# Altium schematic sheet Cosmic.SchDoc
size A; SheetNumber: 3; SheetTotal: 3
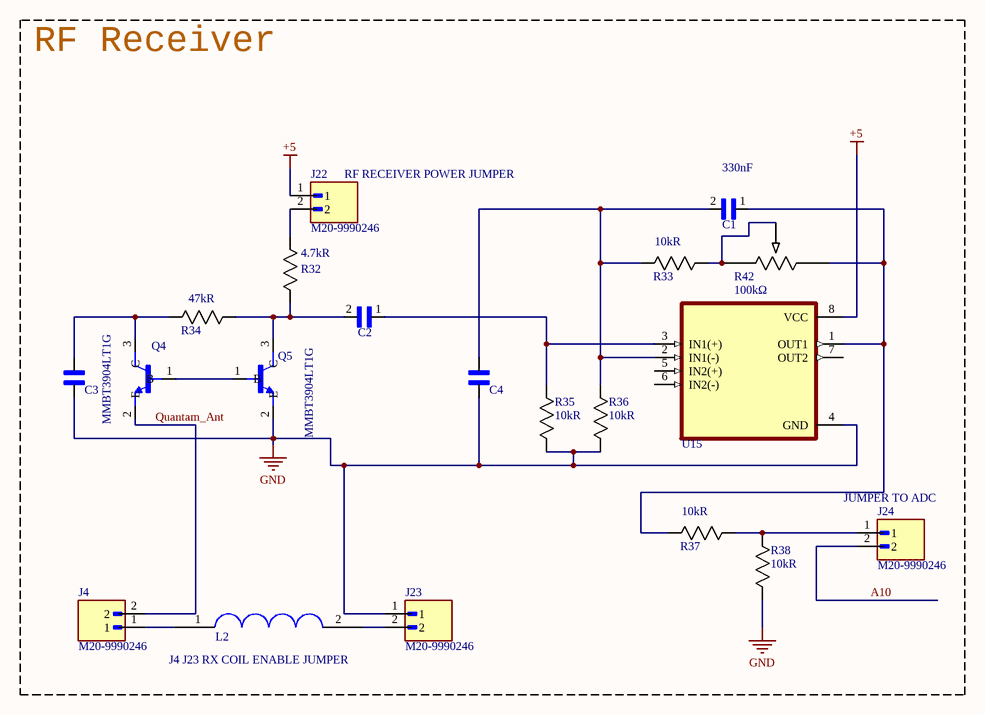
[diagram p0: Cosmic.SchDoc]

## Parts
C1  Capacitance: 330nF  [CAP_1206]  (hidden comment: GRM31C5C1E334GE01L)
C2  GRM31C5C1E334GE01L  [CAP_1206]  (value not drawn)
C3  CL21A106KOQNNNG  [CAPC2012X140N]  (value not drawn)
C4  CL21A106KOQNNNG  [CAPC2012X140N]  (value not drawn)
J4  M20-9990246  [HARWIN_M20-9990246]
J22  M20-9990246  [HARWIN_M20-9990246]
J23  M20-9990246  [HARWIN_M20-9990246]
J24  M20-9990246  [HARWIN_M20-9990246]
L2  COIL_PLANNER_A  [COIL_PLANNER_A]  (value not drawn)  (no BOM)
Q4  MMBT3904LT1G  [SOT95P240X111-3N]
Q5  MMBT3904LT1G  [SOT95P240X111-3N]
R32  Resistance: 4.7kR  [STA_RMCF1206_STP-L]  (hidden comment: RC1206FR-074K7L)
R33  Resistance: 10kR  [STA_RMCF1206_STP-L]  (hidden comment: RC1206FR-0710KL)
R34  Resistance: 47kR  [STA_RMCF1206_STP-L]  (hidden comment: CRGCQ1206F47K)
R35  Resistance: 10kR  [STA_RMCF1206_STP-L]  (hidden comment: RC1206FR-0710KL)
R36  Resistance: 10kR  [STA_RMCF1206_STP-L]  (hidden comment: RC1206FR-0710KL)
R37  Resistance: 10kR  [STA_RMCF1206_STP-L]  (hidden comment: RC1206FR-0710KL)
R38  Resistance: 10kR  [STA_RMCF1206_STP-L]  (hidden comment: RC1206FR-0710KL)
R42  Resistance: 100kΩ  [POT_PV36W_BRN]  (hidden comment: PV36W104C01B00)
U15  LM358MX/NOPB  [SOIC127P599X175-8N]  (value not drawn)

## Nets
+5: J22.1 U15.8(VCC)
GND: C3.1 C4.1 J23.1 Q5.2(E) R35.1 R36.1 R38.1 U15.4(GND)
A10: J24.2
Quantam_Ant: J4.2 Q4.2(E)
NetC1_1: C1.1 R37.1 R42.3 U15.1(OUT1)
NetC1_2: C1.2 C4.2 R33.1 R36.2 U15.2(IN1(-))
NetC2_1: C2.1 R35.2 U15.3(IN1(+))
NetC2_2: C2.2 Q5.3(C) R32.1 R34.2
NetC3_2: C3.2 Q4.3(C) R34.1
NetJ4_1: J4.1 L2.1
NetJ22_2: J22.2 R32.2
NetJ23_2: J23.2 L2.2
NetJ24_1: J24.1 R37.2 R38.2
NetQ4_1: Q4.1(B) Q5.1(B)
NetR33_2: R33.2 R42.1 R42.2

Not connected (* = marked no-connect by the designer): U15 5(IN2(+)) 6(IN2(-)) 7(OUT2)

## Notes on the sheet
- RF Receiver
- (near J22) RF RECEIVER POWER JUMPER
- (near J24) JUMPER TO ADC
- (near L2) J4 J23 RX COIL ENABLE JUMPER

## Library data of the parts
C1 = C334_1206: Cap, 0.33Uf, 25V, 1206, C0G/Np0 Rohs Compliant: Yes |Murata GRM31C5C1E334GE01L; Manufacturer: Murata; Material: 4241ConductorMaterial; Temperature Coefficient: 30ppm/°C; Tolerance: 2%; Supplier 1: Digikey; Manufacturer Part Number: GRM31C5C1E334GE01L; RoHS: No; Category: Ceramic Capacitors; Stock 1: 1673; Pricing 1: 1=0.81, 10=0.508, 50=0.391, 100=0.3549, 500=0.31812, 1000=0.30146 (USD); Case/Package: 340Case; Min Operating Temperature: -55°C; Max Operating Temperature: 125°C; Voltage Rating: 25V; Voltage Rating (DC): 25V; Length: 3.2mm; Width: 1.6mm; Height: 1.8mm; Thickness: 1.6mm; RoHS Compliant: Yes; ComponentLink1URL: https://datasheet.octopart.com/GRM31C5C1E334GE01L-Murata-datasheet-165579666.pdf?src-supplier=TME; ComponentLink1Description: https://datasheet.octopart.com/GRM31C5C1E334GE01L-Murata-datasheet-165579666.pdf?src-supplier=TME; Supplier Part Number 1: 490-GRM31C5C1E334GE01LCT-ND
C2 = C334_1206: Cap, 0.33Uf, 25V, 1206, C0G/Np0 Rohs Compliant: Yes |Murata GRM31C5C1E334GE01L; Manufacturer: Murata; Material: 4241ConductorMaterial; Capacitance: 330nF; Temperature Coefficient: 30ppm/°C; Tolerance: 2%; Supplier 1: Digikey; Manufacturer Part Number: GRM31C5C1E334GE01L; RoHS: No; Category: Ceramic Capacitors; Stock 1: 1673; Pricing 1: 1=0.81, 10=0.508, 50=0.391, 100=0.3549, 500=0.31812, 1000=0.30146 (USD); Case/Package: 340Case; Min Operating Temperature: -55°C; Max Operating Temperature: 125°C; Voltage Rating: 25V; Voltage Rating (DC): 25V; Length: 3.2mm; Width: 1.6mm; Height: 1.8mm; Thickness: 1.6mm; RoHS Compliant: Yes; ComponentLink1URL: https://datasheet.octopart.com/GRM31C5C1E334GE01L-Murata-datasheet-165579666.pdf?src-supplier=TME; ComponentLink1Description: https://datasheet.octopart.com/GRM31C5C1E334GE01L-Murata-datasheet-165579666.pdf?src-supplier=TME; Supplier Part Number 1: 490-GRM31C5C1E334GE01LCT-ND
C3 C4 = 10uF16v0805: 10 ÂµF Â±10% 16V Ceramic Capacitor X5R 0805 (2012 Metric); MF: Samsung Electro-Mechanics; SnapEDA_Link: https://www.snapeda.com/parts/CL21A106KOQNNNG/Samsung/view-part/?ref=snap; Package: 2012-2 SAMSUNG; Value: *; MP: CL21A106KOQNNNG; Check_prices: https://www.snapeda.com/parts/CL21A106KOQNNNG/Samsung/view-part/?ref=eda; Supplier Part Number 1: 1276-6455-2-ND
J4 J22-J24 = M20-9990246: 2.54mm (0.1) Pitch SIL Vertical Throughboard Pin Header, 6.1mm mating pin height, tin, 2 contacts; MF: Harwin; SnapEDA_Link: https://www.snapeda.com/parts/M20-9990246/Harwin/view-part/?ref=snap; Package: None; Value: *; MP: M20-9990246; Check_prices: https://www.snapeda.com/parts/M20-9990246/Harwin/view-part/?ref=eda; Supplier Part Number 1: 952-2262-ND
Q4 Q5 = MMBT3904LT1G: Transistor, Bipolar,Si,NPN,General Purpose,VCEO 40VDC,IC 200mA,PD 225mW,SOT-23 | ON Semiconductor MMBT3904LT1G; SnapEDA_Link: https://www.snapeda.com/parts/MMBT3904LT1G/Onsemi/view-part/?ref=snap; Package: SOT-23-3 ON Semiconductor; Value: *; MF: ON Semiconductor; MP: MMBT3904LT1G; Check_prices: https://www.snapeda.com/parts/MMBT3904LT1G/Onsemi/view-part/?ref=eda; Supplier Part Number 1: MMBT3904LT1GOSTR-ND
R32 = R4K7_1206F: SMD Chip Resistor 4.7 Kohm ½ 1% 250 Mw 1206 [3216 Metric] Thick Film General Purpose; Manufacturer: Yageo; Voltage Rating: 200V; Power Rating: 250mW; Temperature Coefficient: 100ppm/°C; Supplier 1: Digikey; Manufacturer Part Number: RC1206FR-074K7L; RoHS: Yes; Category: Chip SMD Resistors; Stock 1: 1407521; Pricing 1: 1=0.1, 10=0.015, 25=0.0112, 50=0.0102 (USD); Case/Package: 1206; Number of Pins: 2; Case Code (Imperial): 1206; Case Code (Metric): 3216; Size Code: 1206; Min Operating Temperature: -55°C; Max Operating Temperature: 155°C; Tolerance: 1%; Packaging: Tape and Reel; Voltage Rating (AC): 200V; Voltage Rating (DC): 200V; Resistor Type: Thick Film; Series: RC02H; Resistance Tolerance: 1%; Width: 1.6mm; Lead Free: Lead Free; Reach SVHC Compliant: Unknown; RoHS Compliant: Yes; ComponentLink1URL: https://datasheet.ciiva.com/7857/1692832-7857365.pdf?src-supplier=Element14; ComponentLink1Description: https://datasheet.ciiva.com/7857/1692832-7857365.pdf?src-supplier=Element14; ComponentLink2URL: https://datasheet.ciiva.com/16781/pyu-rc1206-51-rohs-l-4-16781672.pdf?src-supplier=Future+Electronics; ComponentLink2Description: https://datasheet.ciiva.com/16781/pyu-rc1206-51-rohs-l-4-16781672.pdf?src-supplier=Future+Electronics; Supplier Part Number 1: 311-4.70KFRCT-ND
R33 R35-R38 = R10K-1206: 250Mw Thick Film Resistors 100Ppm/ 1% 10K 1206 Chip Resistor Surface Mount Rohs; Manufacturer: Yageo; Voltage Rating: 200V; Temperature Coefficient: 100ppm/°C; Supplier 1: Digikey; Manufacturer Part Number: RC1206FR-0710KL; RoHS: Yes; Category: Chip SMD Resistors; Stock 1: 1307460; Pricing 1: 1=0.1, 10=0.018, 25=0.0152, 50=0.0112 (USD); Case/Package: 1206; Case Code (Imperial): 1206; Case Code (Metric): 3216; Size Code: 1206; Min Operating Temperature: -55°C; Max Operating Temperature: 155°C; Power Rating: 250mW; Tolerance: 1%; Packaging: Tape and Reel; Termination: SMD/SMT; Resistor Type: Thick Film; Series: RC; Resistance Tolerance: 1%; Voltage Rating (AC): 200V; Features: Moisture Resistant; Max Power Dissipation: 250mW; Number of Terminations: 2; Package Quantity: 5000; Length: 3.1mm; Width: 1.6mm; Height: 0.55mm; Lead Free: Lead Free; Reach SVHC Compliant: Unknown; RoHS Compliant: Yes; ComponentLink1URL: https://datasheet.ciiva.com/7857/1692832-7857244.pdf?src-supplier=Element14; ComponentLink1Description: https://datasheet.ciiva.com/7857/1692832-7857244.pdf?src-supplier=Element14; ComponentLink2URL: https://datasheet.ciiva.com/7857/1692832-7857245.pdf?src-supplier=Element14; ComponentLink2Description: https://datasheet.ciiva.com/7857/1692832-7857245.pdf?src-supplier=Element14; ComponentLink3URL: https://datasheet.ciiva.com/46445/444357-46445703.pdf?src-supplier=Element14; ComponentLink3Description: https://datasheet.ciiva.com/46445/444357-46445703.pdf?src-supplier=Element14; Supplier Part Number 1: 311-10.0KFRCT-ND
R34 = R47K1206F: SMD Chip Resistor, 47 kOhm, ± 1%, 250 mW, 1206 [3216 Metric], Thick Film, General Purpose; Manufacturer: TE Connectivity; Max Power Dissipation: 250mW; Temperature Coefficient: 100ppm/°C; Voltage Rating: 200V; Supplier 1: Digikey; Manufacturer Part Number: CRGCQ1206F47K; RoHS: Yes; Category: Chip SMD Resistors; Stock 1: 608846; Pricing 1: 1=0.1, 10=0.046, 25=0.0352, 50=0.0238, 100=0.0196, 250=0.0174, 500=0.01666, 1000=0.01451 (USD); Case/Package: 1206; Case Code (Imperial): 1206; Case Code (Metric): 3216; Min Operating Temperature: -55°C; Max Operating Temperature: 155°C; Features: Moisture Resistant,Automotive AEC-Q200; Packaging: Cut Tape; Tolerance: 1%; Number of Terminations: 2; Series: CRGCQ; Power Rating: 250mW; Voltage Rating (DC): 200V; Operating Supply Voltage: 200V; Height: 650um; Ratings: AEC-Q200; RoHS Compliant: Yes; ComponentLink1URL: https://www.te.com/commerce/DocumentDelivery/DDEController?Action=srchrtrv&DocNm=1773204-3&DocType=DS&DocLang=English&src-supplier=Digikey; ComponentLink1Description: https://www.te.com/commerce/DocumentDelivery/DDEController?Action=srchrtrv&DocNm=1773204-3&DocType=DS&DocLang=English&src-supplier=Digikey; ComponentLink2URL: https://www.te.com/commerce/DocumentDelivery/DDEController?Action=srchrtrv&amp;DocNm=1773204-3&amp;DocType=DS&amp;DocLang=English&src-supplier=Digikey; ComponentLink2Description: https://www.te.com/commerce/DocumentDelivery/DDEController?Action=srchrtrv&amp;DocNm=1773204-3&amp;DocType=DS&amp;DocLang=English&src-supplier=Digikey; ComponentLink3URL: https://4donline.ihs.com/images/VipMasterIC/IC/TYEL/TYEL-S-A0004929575/TYEL-S-A0004929575-1.pdf?hkey=52A5661711E402568146F3353EA87419&src-supplier=Farnell; ComponentLink3Description: https://4donline.ihs.com/images/VipMasterIC/IC/TYEL/TYEL-S-A0004929575/TYEL-S-A0004929575-1.pdf?hkey=52A5661711E402568146F3353EA87419&src-supplier=Farnell; ComponentLink4URL: https://datasheet.octopart.com/CRGCQ1206F47K-TE-Connectivity-datasheet-114679081.pdf?src-supplier=Master+Electronics; ComponentLink4Description: https://datasheet.octopart.com/CRGCQ1206F47K-TE-Connectivity-datasheet-114679081.pdf?src-supplier=Master+Electronics; Supplier Part Number 1: A129830CT-ND
R42 = POT100K: Cermet trimmer potentiometer, 25 turns, 100 kΩ, 0.5 W, THT, on top, PV36W104C01B00; Manufacturer: Bourns; Lead Diameter: 510µm; Lead Length: 6.4mm; Max Power Dissipation: 500mW; Number of Turns: 25; Temperature Coefficient: 100ppm/°C; Tolerance: 10%; Supplier 1: DigiKey; Manufacturer Part Number: PV36W104C01B00; RoHS: Compliant; Category: Variable Resistors and Potentiometers; Stock 1: 59475; Pricing 1: 1=1.53, 10=1.291, 25=1.2048, 50=1.1432, 100=1.0844, 250=1.01108, 500=0.95864, 1000=0.90877, 5000=0.80229 (USD); Composition: Cermet; Contact Plating: Tin; Height: 10.03mm; Lifecycle Status: Production; Max Operating Temperature: 125°C; Min Operating Temperature: -55°C; Mount: Through Hole; Number of Terminals: 3; Power Dissipation: 500mW; REACH SVHC: No; Schedule B: 8533400080, 8533400080|8533400080|8533400080|8533400080|8533400080; Termination: PC Pins; Width: 4.83mm; ComponentLink1URL: https://datasheet.octopart.com:443/PV36W104C01B00-Bourns-datasheet-182141976.pdf?src-supplier=IHS; ComponentLink1Description: https://datasheet.octopart.com:443/PV36W104C01B00-Bourns-datasheet-182141976.pdf?src-supplier=IHS; ComponentLink2URL: https://datasheet.octopart.com:443/PV36W104C01B00-Bourns-datasheet-154729827.pdf?src-supplier=Electro+Sonic; ComponentLink2Description: https://datasheet.octopart.com:443/PV36W104C01B00-Bourns-datasheet-154729827.pdf?src-supplier=Electro+Sonic; ComponentLink3URL: https://datasheet.octopart.com:443/PV36W104C01B00-Bourns-datasheet-177040424.pdf?src-supplier=Burklin+Elektronik; ComponentLink3Description: https://datasheet.octopart.com:443/PV36W104C01B00-Bourns-datasheet-177040424.pdf?src-supplier=Burklin+Elektronik; ComponentLink4URL: https://datasheet.octopart.com:443/PV36W104C01B00-Bourns-datasheet-165058412.pdf?src-supplier=Burklin+Elektronik; ComponentLink4Description: https://datasheet.octopart.com:443/PV36W104C01B00-Bourns-datasheet-165058412.pdf?src-supplier=Burklin+Elektronik; ComponentLink5URL: https://datasheet.octopart.com:443/PV36W104C01B00-Bourns-datasheet-142044744.pdf?src-supplier=RS+(Formerly+Allied+Electronics); ComponentLink5Description: https://datasheet.octopart.com:443/PV36W104C01B00-Bourns-datasheet-142044744.pdf?src-supplier=RS+(Formerly+Allied+Electronics); ComponentLink6URL: https://datasheet.octopart.com:443/PV36W104C01B00-Bourns-datasheet-103142593.pdf?src-supplier=TME; ComponentLink6Description: https://datasheet.octopart.com:443/PV36W104C01B00-Bourns-datasheet-103142593.pdf?src-supplier=TME; ComponentLink7URL: https://datasheet.octopart.com:443/PV36W104C01B00-Bourns-datasheet-12516445.pdf?src-supplier=X-ON; ComponentLink7Description: https://datasheet.octopart.com:443/PV36W104C01B00-Bourns-datasheet-12516445.pdf?src-supplier=X-ON; ComponentLink8URL: http://sigma.octopart.com:80/conflict_mineral_statement/Bourns-company-36.pdf?src-supplier=Compliance+Statements; ComponentLink8Description: http://sigma.octopart.com:80/conflict_mineral_statement/Bourns-company-36.pdf?src-supplier=Compliance+Statements; Supplier Part Number 1: 118-PV36W104C01B00-ND
U15 = LM358MX/NOPB: ROHS3Compliant EAR99 LM358 Tape & Reel (TR) op amp amplifier circuit 4.9mm 0.05muA 7mV 1000kHz; Manufacturer: TI National Semiconductor; Bandwidth: 1MHz; Slew Rate: 0.1V/µs; Min Supply Voltage: 3V; Max Supply Voltage: 32V; Min Dual Supply Voltage: 1.5V; Max Dual Supply Voltage: 16V; Voltage Gain: 100dB; Common Mode Rejection Ratio: 65dB; Number of Circuits: 2; Input Offset Voltage (Vos): 2mV; Input Bias Current: 45nA; Operating Supply Current: 1mA; Power Dissipation: 530mW; Amplifier Type: GENERAL PURPOSE; Output Current per Channel: 40mA; Supplier 1: Digikey; Manufacturer Part Number: LM358MX/NOPB; RoHS: Yes; Category: Amplifiers - Op Amps, Buffer, Instrumentation; Stock 1: 13116; Pricing 1: 1=0.81, 10=0.576, 25=0.5184, 100=0.455, 250=0.42464, 500=0.40636, 1000=0.3913 (USD); Mount: Surface Mount; Case/Package: SOIC; Number of Pins: 8; Min Operating Temperature: 0°C; Max Operating Temperature: 70°C; Packaging: Tape and Reel; Unity Gain Bandwidth Product: 1MHz; Gain Bandwidth Product: 1MHz; Number of Amplifiers: 2; Number of Elements: 2; Power Supply Rejection Ratio (PSRR): 65dB; Series: -; Technology: BIPOLAR; Length: 4.9mm; Width: 3.91mm; Height: 1.75mm; Thickness: 1.58mm; Reach SVHC Compliant: No; Lead Free: Lead Free; ComponentLink1URL: https://datasheet.ciiva.com/6631/lm158-n-6631238.pdf?src-supplier=Digikey; ComponentLink1Description: https://datasheet.ciiva.com/6631/lm158-n-6631238.pdf?src-supplier=Digikey; ComponentLink2URL: https://datasheet.ciiva.com/6631/lm158-n-6631239.pdf?src-supplier=Digikey; ComponentLink2Description: https://datasheet.ciiva.com/6631/lm158-n-6631239.pdf?src-supplier=Digikey; ComponentLink3URL: https://datasheet.ciiva.com/6631/lm158-n-6631240.pdf?src-supplier=Digikey; ComponentLink3Description: https://datasheet.ciiva.com/6631/lm158-n-6631240.pdf?src-supplier=Digikey; ComponentLink4URL: https://datasheet.ciiva.com/8009/28655-8009193.pdf?src-supplier=Element14; ComponentLink4Description: https://datasheet.ciiva.com/8009/28655-8009193.pdf?src-supplier=Element14; Supplier Part Number 1: LM358MX/NOPBCT-ND